# EAGLE design mightIO (EAGLE 6.5.0)
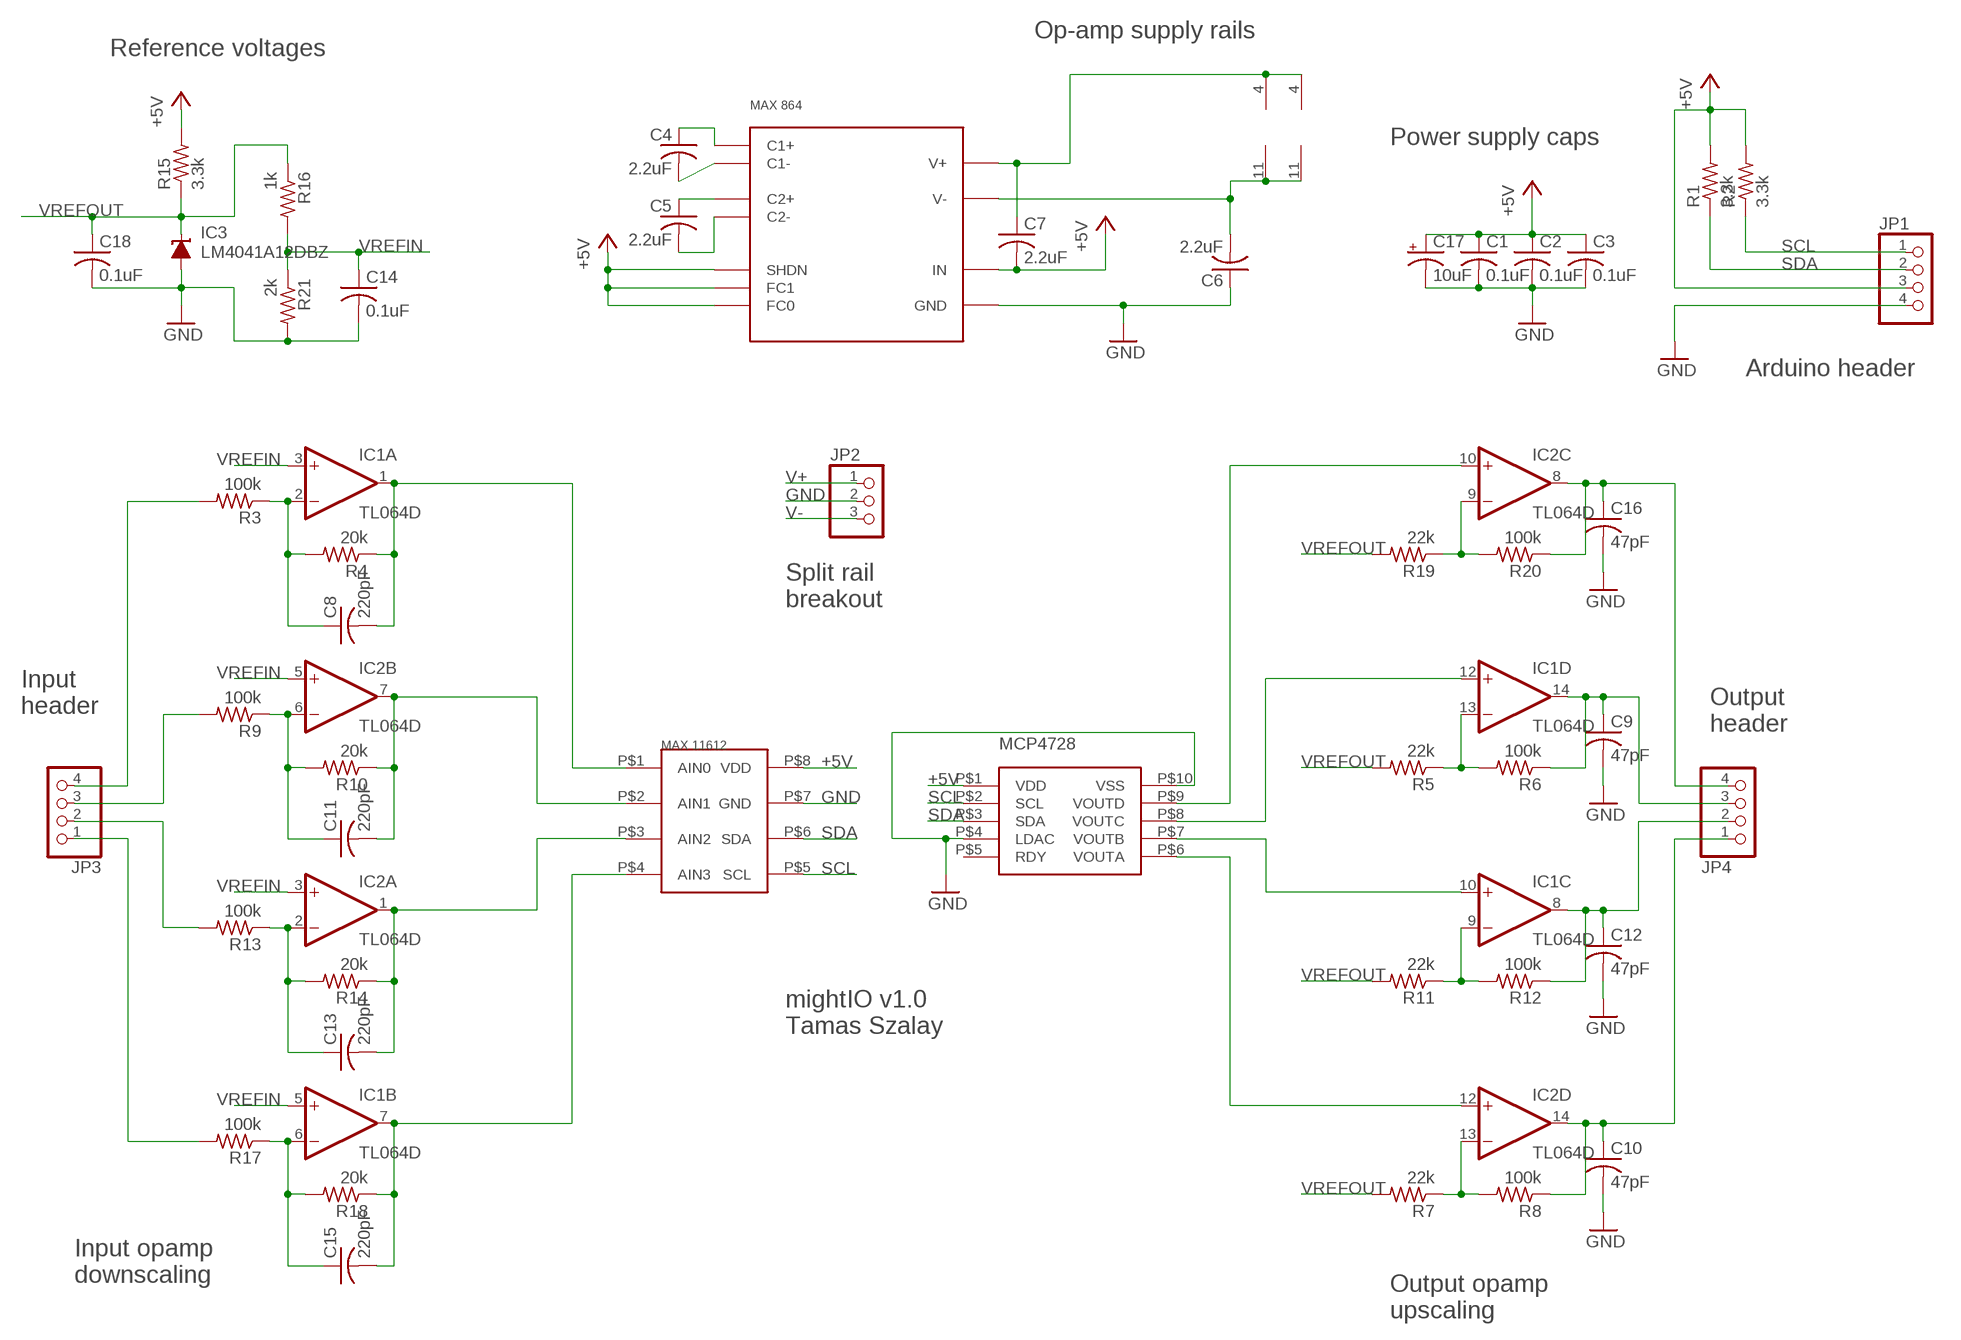
[diagram p0: schematic, sheet 1]

## Parts
C1  0.1uF  C-USC0603  [C0603]
C2  0.1uF  C-USC0603  [C0603]
C3  0.1uF  C-USC0603  [C0603]
C4  2.2uF  C-USC0603  [C0603]
C5  2.2uF  C-USC0603  [C0603]
C6  2.2uF  C-USC0603  [C0603]
C7  2.2uF  C-USC0603  [C0603]
C8  220pF  C-USC0603  [C0603]
C9  47pF  C-USC0603  [C0603]
C10  47pF  C-USC0603  [C0603]
C11  220pF  C-USC0603  [C0603]
C12  47pF  C-USC0603  [C0603]
C13  220pF  C-USC0603  [C0603]
C14  0.1uF  C-USC0603  [C0603]
C15  220pF  C-USC0603  [C0603]
C16  47pF  C-USC0603  [C0603]
C17  10uF  CPOL-USE2.5-6  [E2,5-6]
C18  0.1uF  C-USC0603  [C0603]
IC1  TL064D  [SO14]
IC2  TL064D  [SO14]
IC3  LM4041A12DBZ  [DBZ_R-PDSO-G3]
JP1  PINHD-1X4  [1X04]
JP2  PINHD-1X3  [1X03]
JP3  PINHD-1X4  [1X04]
JP4  PINHD-1X4  [1X04]
R1  3.3k  R-US_R0603  [R0603]
R2  3.3k  R-US_R0603  [R0603]
R3  100k  R-US_R0603  [R0603]
R4  20k  R-US_R0603  [R0603]
R5  22k  R-US_R0603  [R0603]
R6  100k  R-US_R0603  [R0603]
R7  22k  R-US_R0603  [R0603]
R8  100k  R-US_R0603  [R0603]
R9  100k  R-US_R0603  [R0603]
R10  20k  R-US_R0603  [R0603]
R11  22k  R-US_R0603  [R0603]
R12  100k  R-US_R0603  [R0603]
R13  100k  R-US_R0603  [R0603]
R14  20k  R-US_R0603  [R0603]
R15  3.3k  R-US_R0603  [R0603]
R16  1k  R-US_R0603  [R0603]
R17  100k  R-US_R0603  [R0603]
R18  20k  R-US_R0603  [R0603]
R19  22k  R-US_R0603  [R0603]
R20  100k  R-US_R0603  [R0603]
R21  2k  R-US_R0603  [R0603]
U1  MAX11612  [MAX11612]
U$1  MAX864  [MAX864]
U$2  MCP4728  [MCP4728]

## Nets
+5V [pwr]: C1.1 C2.1 C3.1 C7.2 C17.+ JP1.3 R1.2 R2.2 R15.2 U1.P$8(VDD) U$1.P$6(SHDN) U$1.P$7(FC1) U$1.P$8(FC0) U$1.P$12(IN) U$2.P$1(VDD)
AI0: JP3.4 R3.2
AI1: JP3.3 R9.2
AI2: JP3.2 R13.2
AI3: JP3.1 R17.2
AOA: C10.1 IC2.14(D:OUT) JP4.1 R8.1
AOB: C12.1 IC1.8(C:OUT) JP4.2 R12.1
AOC: C9.1 IC1.14(D:OUT) JP4.3 R6.1
AOD: C16.1 IC2.8(C:OUT) JP4.4 R20.1
GND [pwr]: C1.2 C2.2 C3.2 C6.1 C9.2 C10.2 C12.2 C14.2 C16.2 C17.- C18.2 IC3.2(A) JP1.4 JP2.2 R21.2 U1.P$7(GND) U$1.P$3(GND) U$1.P$11(GND) U$2.P$4(LDAC) U$2.P$10(VSS)
N$1: IC2.10(C:+IN) U$2.P$9(VOUTD)
N$2: IC2.9(C:-IN) R19.1 R20.2
N$3: IC1.10(C:+IN) U$2.P$7(VOUTB)
N$4: IC1.13(D:-IN) R5.1 R6.2
N$5: IC1.9(C:-IN) R11.1 R12.2
N$6: IC2.13(D:-IN) R7.1 R8.2
N$7: C4.1 U$1.P$16(C1+)
N$8: C4.2 U$1.P$1(C1-)
N$9: C5.1 U$1.P$2(C2+)
N$10: C5.2 U$1.P$4(C2-)
N$11: C8.1 IC1.2(A:-IN) R3.1 R4.2
N$12: C13.2 IC2.1(A:OUT) R14.1 U1.P$3(AIN2)
N$18: C8.2 IC1.1(A:OUT) R4.1 U1.P$1(AIN0)
N$19: C11.1 IC2.6(B:-IN) R9.1 R10.2
N$20: C11.2 IC2.7(B:OUT) R10.1 U1.P$2(AIN1)
N$22: C15.2 IC1.7(B:OUT) R18.1 U1.P$4(AIN3)
N$23: C13.1 IC2.2(A:-IN) R13.1 R14.2
N$25: IC2.12(D:+IN) U$2.P$6(VOUTA)
N$27: C15.1 IC1.6(B:-IN) R17.1 R18.2
N$34: IC1.12(D:+IN) U$2.P$8(VOUTC)
SCL: JP1.1 R2.1 U1.P$5(SCL) U$2.P$2(SCL)
SDA: JP1.2 R1.1 U1.P$6(SDA) U$2.P$3(SDA)
V+: C7.1 IC1.4(P:V+) IC2.4(P:V+) JP2.1 U$1.P$15(V+)
V-: C6.2 IC1.11(P:V-) IC2.11(P:V-) JP2.3 U$1.P$5(V-)
VREFIN: C14.1 IC1.3(A:+IN) IC1.5(B:+IN) IC2.3(A:+IN) IC2.5(B:+IN) R16.2 R21.1
VREFOUT: C18.1 IC3.1(C) R5.2 R7.2 R11.2 R15.1 R16.1 R19.2
Unconnected: U$2.P$5(RDY)

## Notes on the sheet
- Op-amp supply rails
- Reference voltages
- Power supply caps
- Arduino header
- Split rail
  breakout
- Input
  header
- Output
  header
- mightIO v1.0
  Tamas Szalay
- Input opamp
  downscaling
- Output opamp
  upscaling

## Library data of the parts
C1-C16 C18 = rcl:C-US: CAPACITOR, American symbol
C17 = rcl:CPOL-US: POLARIZED CAPACITOR, American symbol
IC1 IC2 = linear:TL064: OP AMP
IC3 = texas:LM4041: PRECISION MICROPOWER SHUNT VOLTAGE REFERENCE Source: http://focus.ti.com/lit/ds/slcs146e/slcs146e.pdf; MPN: LM4041A12IDBZR; OC_FARNELL: 1407949; OC_NEWARK: 58K5875
JP1 JP3 JP4 = pinhead:PINHD-1X4: PIN HEADER
JP2 = pinhead:PINHD-1X3: PIN HEADER
R1-R21 = rcl:R-US_: RESISTOR, American symbol
U1 = Andrew:MAX11612
U$1 = Andrew:MAX864
U$2 = Andrew:MCP4728

## Net classes
0 default: width 0.254 mm
1 pwr: width 0.254 mm

## Board
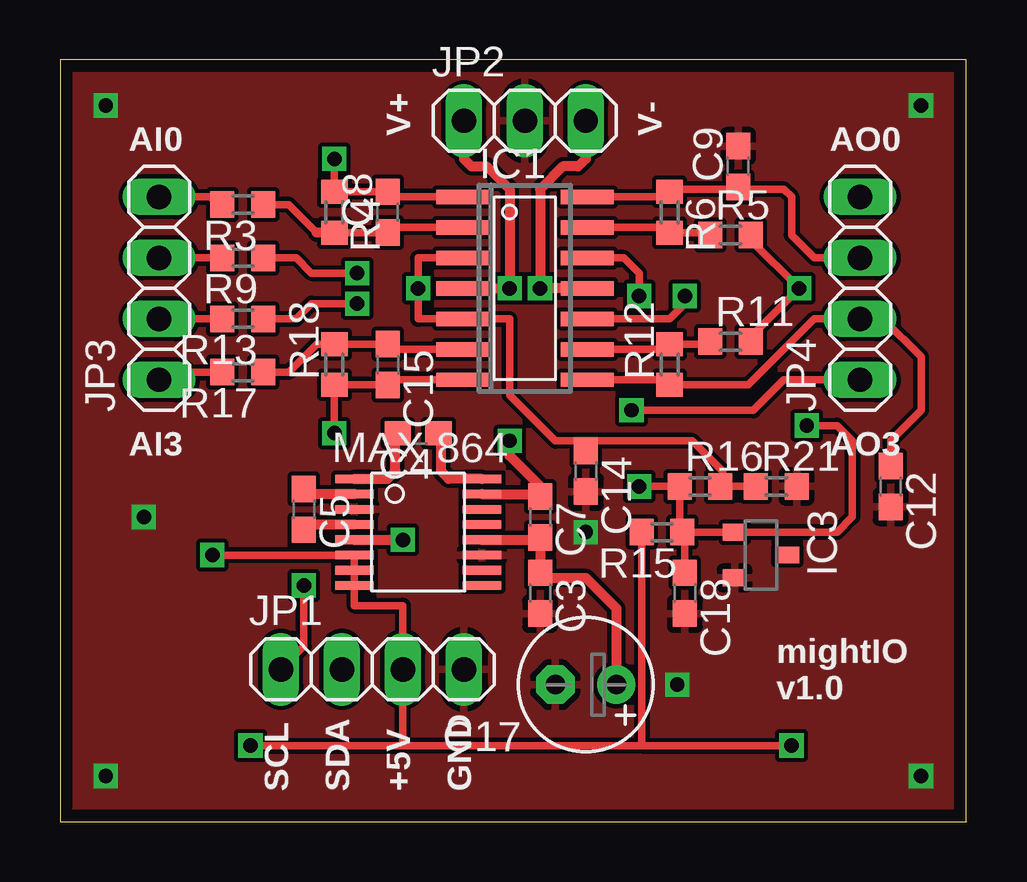
[diagram p1: board, top side]
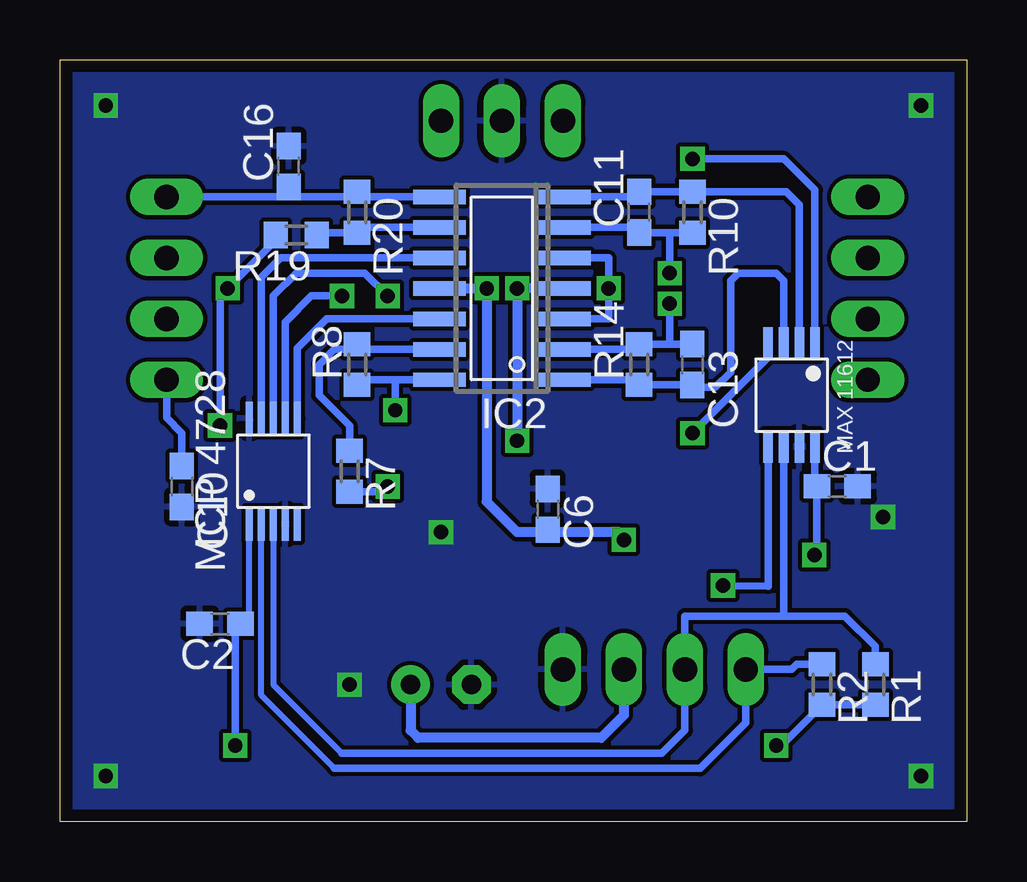
[diagram p2: board, bottom side, seen from below]

Size 37.78 x 31.74 mm. Coordinates in mm from the lower left corner, seen from the top.
Outline: 37.77,0 37.77,31.74 0,31.74 0,0 37.78,0
Copper layers (1*16): Top 0.035mm / dielectric 1.5mm / Bottom 0.035mm
Design rules "default *": minimum track width 10mil, minimum drill 23mil, track to track 7mil, track to pad 7mil, pad to pad 7mil, via to via 8mil, smd to smd 0mil, copper to edge 20mil, drill to drill 8mil, minimum pad ring 10mil, minimum via ring 8mil, stop-mask expansion 4mil, vias tented up to drill 0mil, thermal gap 10mil

### Footprints (pad centres in the part's own frame; a part is rotated, then mirrored left to right if it is on the bottom)
C0603 = smd 1.1 x 1: 1 -0.85,0; 2 0.85,0
E2,5-6 = drill 0.813 pad 1.6: + -1.27,0 | drill 0.813 pad 1.6 octagon: - 1.27,0
SO14 = smd 0.6 x 2.2: 1 -3.81,-2.6; 2 -2.54,-2.6; 3 -1.27,-2.6; 4 0,-2.6; 5 1.27,-2.6; 6 2.54,-2.6; 7 3.81,-2.6; 8 3.81,2.6; 9 2.54,2.6; 10 1.27,2.6; 11 0,2.6; 12 -1.27,2.6; 13 -2.54,2.6; 14 -3.81,2.6
DBZ_R-PDSO-G3 = smd 0.7 x 1: 1 -0.95,-1.1; 2 0.95,-1.1; 3 0,1.1
1X04 = drill 1.016 long: 1 -3.81,0; 2 -1.27,0; 3 1.27,0; 4 3.81,0
1X03 = drill 1.016 long: 1 -2.54,0; 2 0,0; 3 2.54,0
R0603 = smd 1 x 1.1: 1 -0.85,0; 2 0.85,0
MAX11612 = smd 1.35 x 0.4: P$1 -2.15,0.975; P$2 -2.15,0.325; P$3 -2.15,-0.325; P$4 -2.15,-0.975; P$5 2.15,-0.975; P$6 2.15,-0.325; P$7 2.15,0.325; P$8 2.15,0.975
MAX864 = smd 1.6 x 0.36: P$1 -2.655,2.223; P$2 -2.655,1.587; P$3 -2.655,0.953; P$4 -2.655,0.318; P$5 -2.655,-0.318; P$6 -2.655,-0.953; P$7 -2.655,-1.587; P$8 -2.655,-2.223; P$9 2.655,-2.223; P$10 2.655,-1.587; P$11 2.655,-0.953; P$12 2.655,-0.318; P$13 2.655,0.318; P$14 2.655,0.953; P$15 2.655,1.587; P$16 2.655,2.223
MCP4728 = smd 1.4 x 0.3: P$1 -2.2,1; P$2 -2.2,0.5; P$3 -2.2,0; P$4 -2.2,-0.5; P$5 -2.2,-1; P$6 2.2,-1; P$7 2.2,-0.5; P$8 2.2,0; P$9 2.2,0.5; P$10 2.2,1

### Placement (x,y rotation side)
C1  5.4,13.97 0 bottom
C2  31.11,8.26 180 bottom
C3  20,9.53 270 top
C4  14.92,16.19 180 top
C5  10.16,13.02 270 top
C6  17.46,13.02 270 bottom
C7  20,12.7 270 top
C8  13.65,25.4 90 top
C9  28.26,27.3 90 top
C10  32.7,13.97 270 bottom
C11  13.65,25.4 90 bottom
C12  34.61,13.97 270 top
C13  11.43,19.05 270 bottom
C14  21.91,14.61 270 top
C15  13.65,19.05 270 top
C16  28.26,27.3 90 bottom
C17  21.91,5.71 180 top
C18  26.04,9.53 270 top
IC1  19.37,22.23 270 top
IC2  19.37,22.23 90 bottom
IC3  29.21,11.11 270 top
JP1  13.02,6.35 0 top
JP2  19.37,29.21 0 top
JP3  4.13,22.23 90 top
JP4  33.34,22.23 90 top
R1  3.81,5.71 270 bottom
R2  6.03,5.71 270 bottom
R3  7.62,25.72 180 top
R4  11.43,25.4 270 top
R5  27.94,24.45 0 top
R6  25.4,25.4 270 top
R7  25.72,14.61 270 bottom
R8  25.4,19.05 90 bottom
R9  7.62,23.5 180 top
R10  11.43,25.4 270 bottom
R11  27.94,20 0 top
R12  25.4,19.05 90 top
R13  7.62,20.95 180 top
R14  13.65,19.05 90 bottom
R15  25.08,12.06 180 top
R16  26.67,13.97 0 top
R17  7.62,18.73 180 top
R18  11.43,19.05 90 top
R19  27.94,24.45 180 bottom
R20  25.4,25.4 270 bottom
R21  29.84,13.97 0 top
U1  7.3,17.78 270 bottom
U$1  14.92,12.06 0 top
U$2  28.89,14.61 90 bottom

### Tracks (layer width: path | path; a pad name or v marks a point on that pad's centre or on a via)
+5V  (via drill 0.6)
  Top 0.305: 19.9,11.75 C7.2 | v6.35,11.11 U$1.P$6 U$1.P$7 U$1.P$8 12.27,9.01 14.29,9.01 JP1.3 14.29,3.17 | v7.94,3.17 14.29,3.17 | R15.2 24.23,3.17 | 24.23,3.17 14.29,3.17 | 24.23,3.17 v30.48,3.17 | 20,10.48 C3.1
  Top 0.406: U$1.P$12 19.9,11.75 | 19.9,10.48 C3.1 | C7.2 20,10.48 20.32,10.16 21.91,10.16 23.18,8.89 C17.+
  Bottom 0.254: 29.89,8.04 29.89,8.26 U$2.P$1
  Bottom 0.305: U1.P$8 6.33,14.05 C1.1 6.25,11.21 v6.35,11.11 | R1.2 R2.2 7.72,3.17 v7.94,3.17 | v30.48,3.17 30.48,8.04 C2.1 29.89,8.26
  Bottom 0.406: JP1.3 14.29,4.45 15.24,3.49 22.86,3.49 23.18,3.81 C17.+
AI0
  Top 0.305: JP3.4 6.35,26.04
  Top 0.406: 6.35,26.04 R3.2
AI1
  Top 0.305: JP3.3 R9.2
AI2
  Top 0.305: JP3.2 R13.2
AI3
  Top 0.305: JP3.1 3.81,18.73 R17.2
AOA  (via drill 0.6)
  Top 0.305: JP4.1 30.16,18.41 28.89,17.14 v23.81,17.14
  Bottom 0.305: IC2.14 23.81,18.41 | v23.81,17.14 23.81,18.41 | 23.81,18.41 25.4,18.41 R8.1 | C10.1 32.7,16.19 33.34,16.83 JP4.1
AOB
  Top 0.305: IC1.8 25.4,18.41 R12.1 28.68,18.2 31.43,20.95 JP4.2 34.29,20.95 35.88,19.37 35.88,17.14 34.61,15.88 C12.1
AOC
  Top 0.305: IC1.14 25.4,26.04 R6.1 25.5,26.35 28.57,26.35 | JP4.3 31.43,23.5 30.48,24.45 30.48,26.04 30.16,26.35 28.57,26.35 | C9.1 28.57,26.45 28.57,26.35
AOD
  Bottom 0.305: IC2.8 25.4,26.04 | JP4.4 27.94,26.04 | 27.94,26.04 25.4,26.04 | 25.4,26.04 R20.1 | C16.1 27.94,26.45 27.94,26.04
GND  (via drill 0.6)
  other vias: 21.91,12.06 1.91,29.84 35.88,29.84 35.88,1.91 1.91,1.91 3.49,12.7 25.72,5.71
  pour Top: 0,31.75 37.78,31.75 37.78,0 0,0
  pour Bottom: 0,31.75 37.78,31.75 37.78,0 0,0
N$1
  Bottom 0.305: U$2.P$9 29.39,22.68 28.57,23.5 IC2.10
N$2
  Bottom 0.305: IC2.9 25.4,24.77 R20.2 27.3,24.55 R19.1
N$3  (via drill 0.6)
  Top 0.305: IC1.10 25.4,20.95 26.04,21.59 v26.04,21.91
  Bottom 0.305: U$2.P$7 28.39,20.82 27.3,21.91 v26.04,21.91
N$4
  Top 0.305: IC1.13 25.4,24.77 R6.2 27.3,24.55 R5.1
N$5
  Top 0.305: IC1.9 25.4,19.68 R12.2 26.99,19.9 R11.1
N$6
  Bottom 0.305: IC2.13 25.4,19.68 | 25.4,19.68 R8.2 | 25.4,19.68 26.35,19.68 26.99,19.05 26.99,17.78 25.72,16.51 R7.1
N$7
  Top 0.305: 15.88,16.09 C4.1
  Top 0.406: U$1.P$16 16.19,14.29 15.88,14.61 15.88,16.09
N$8
  Top 0.305: 13.97,16.09 C4.2
  Top 0.406: U$1.P$1 13.65,14.29 13.97,14.61 13.97,16.09
N$9
  Top 0.305: 10.38,13.65 C5.1
  Top 0.406: U$1.P$2 10.38,13.65
N$10
  Top 0.305: 10.38,12.38 C5.2
  Top 0.406: U$1.P$4 10.38,12.38
N$11
  Top 0.305: R4.2 C8.1 | IC1.2 13.87,24.77 | 10.69,24.55 9.53,25.72 R3.1
  Top 0.406: 13.87,24.77 C8.1 | R4.2 10.69,24.55
N$12
  Bottom 0.305: IC2.1 13.87,18.41 | R14.1 C13.2 | U1.P$3 7.63,22.55 7.94,22.86 9.53,22.86 9.84,22.54 9.84,18.73 10.48,18.1 11.33,18.1
  Bottom 0.406: 13.87,18.41 R14.1 | 11.33,18.1 C13.2
N$18  (via drill 0.6)
  Top 0.305: C8.2 R4.1 v11.43,27.62 | IC1.1 13.87,26.04
  Top 0.406: R4.1 11.53,26.25 11.75,26.04 | 13.87,26.04 C8.2
  Bottom 0.305: v11.43,27.62 7.62,27.62 6.33,26.33 U1.P$1
N$19  (via drill 0.6)
  Top 0.305: R9.1 9.84,23.5 10.48,22.86 v12.38,22.86
  Bottom 0.305: IC2.6 13.87,24.77 | R10.2 12.38,24.55 | 12.38,24.55 C11.1 | v12.38,22.86 12.38,24.55
  Bottom 0.406: 13.87,24.77 C11.1
N$20
  Bottom 0.305: 13.87,26.04 IC2.7 | C11.2 R10.1 7.52,26.25 6.98,25.71 U1.P$2
  Bottom 0.406: C11.2 13.87,26.04
N$22  (via drill 0.6)
  Top 0.305: IC1.7 13.87,18.41 | C15.2 R18.1 v11.43,16.19
  Top 0.406: 13.87,18.41 C15.2
  Bottom 0.305: U1.P$4 8.28,19.34 v11.43,16.19
N$23  (via drill 0.6)
  Top 0.305: R13.1 9.84,20.95 10.48,21.59 v12.38,21.59
  Bottom 0.305: IC2.2 13.87,19.68 | R14.2 12.38,19.9 | 12.38,19.9 C13.1 | v12.38,21.59 12.38,19.9
  Bottom 0.406: 13.87,19.68 R14.2
N$25
  Bottom 0.305: U$2.P$6 27.89,19.73 26.67,20.95 IC2.12
N$27
  Top 0.305: C15.1 R18.2 10.69,19.9 9.53,18.73 R17.1 | 13.87,19.68 IC1.6
  Top 0.406: 13.87,19.68 C15.1
N$34  (via drill 0.6)
  Top 0.305: v24.13,21.91 24.13,22.86 23.5,23.5 IC1.12
  Bottom 0.305: U$2.P$8 28.89,21.91 27.94,22.86 25.08,22.86 v24.13,21.91
SCL  (via drill 0.6)
  Top 0.305: JP1.1 10.16,7.3 v10.16,9.84
  Bottom 0.254: 26.35,2.22 29.39,5.26 U$2.P$2
  Bottom 0.305: R2.1 7.09,6.57 7.3,6.35 JP1.1 9.21,4.13 11.11,2.22 26.35,2.22 | U1.P$5 8.28,9.82 v10.16,9.84
SDA
  Bottom 0.254: U$2.P$3 28.89,5.71 26.04,2.86
  Bottom 0.305: R1.1 3.81,7.3 5.08,8.57 7.62,8.57 | 7.62,8.57 11.75,8.57 JP1.2 11.75,3.81 12.7,2.86 26.04,2.86 | U1.P$6 7.63,8.58 7.62,8.57
V+  (via drill 0.6)
  Top 0.305: 19.9,13.65 C7.1
  Top 0.406: IC2.4 v18.73,22.23 18.73,26.35 17.78,27.3 17.14,27.3 16.83,27.62 JP2.1 | U$1.P$15 19.9,13.65 | v18.73,15.88 18.73,15.24 20,13.97 C7.1
  Bottom 0.406: v18.73,15.88 v18.73,22.23 IC2.4
V-  (via drill 0.6)
  Top 0.406: IC1.11 v20,22.23 20,26.35 20.95,27.3 21.59,27.3 21.91,27.62 JP2.3 | U$1.P$5 v14.29,11.75
  Bottom 0.406: IC1.11 v20,22.23 20,13.34 18.73,12.06 17.46,12.06 | v14.29,11.75 14.5,12.06 17.46,12.06 | C6.2 17.46,12.06
VREFIN  (via drill 0.6)
  Top 0.305: R21.1 R16.2 27.62,14.07 27.62,14.61 26.35,15.88 21.91,15.88 | 21.91,15.88 20.64,15.88 18.73,17.78 18.73,20.95 IC2.3 14.92,20.95 v14.92,22.23 14.92,23.5 IC2.5 | C14.1 21.91,15.88
  Bottom 0.305: IC2.5 14.92,23.5 v14.92,22.23 14.92,20.95 IC2.3
VREFOUT  (via drill 0.6)
  Top 0.305: 25.82,12.18 R16.1 v24.13,13.97 | R5.2 28.79,24.23 v30.8,22.23 28.79,20.22 R11.2 | C18.1 26.04,11.96 R15.1 26.57,12.06 IC3.1 32.38,12.06 33.02,12.7 33.02,15.88 32.38,16.51 v31.11,16.51
  Top 0.406: R15.1 25.82,12.18
  Bottom 0.305: R7.2 24.34,13.76 v24.13,13.97 | v31.11,16.51 31.11,21.91 v30.8,22.23 28.79,24.23 R5.2

### Text on the board
tPlace: V+ | V- | AI0 | AO0 | AI3 | AO3 | SCL | SDA | +5V | GND
tNames: mightIO / v1.0